# EAGLE schematic SmartSwitchBoard-2x2LK (EAGLE 6.2)
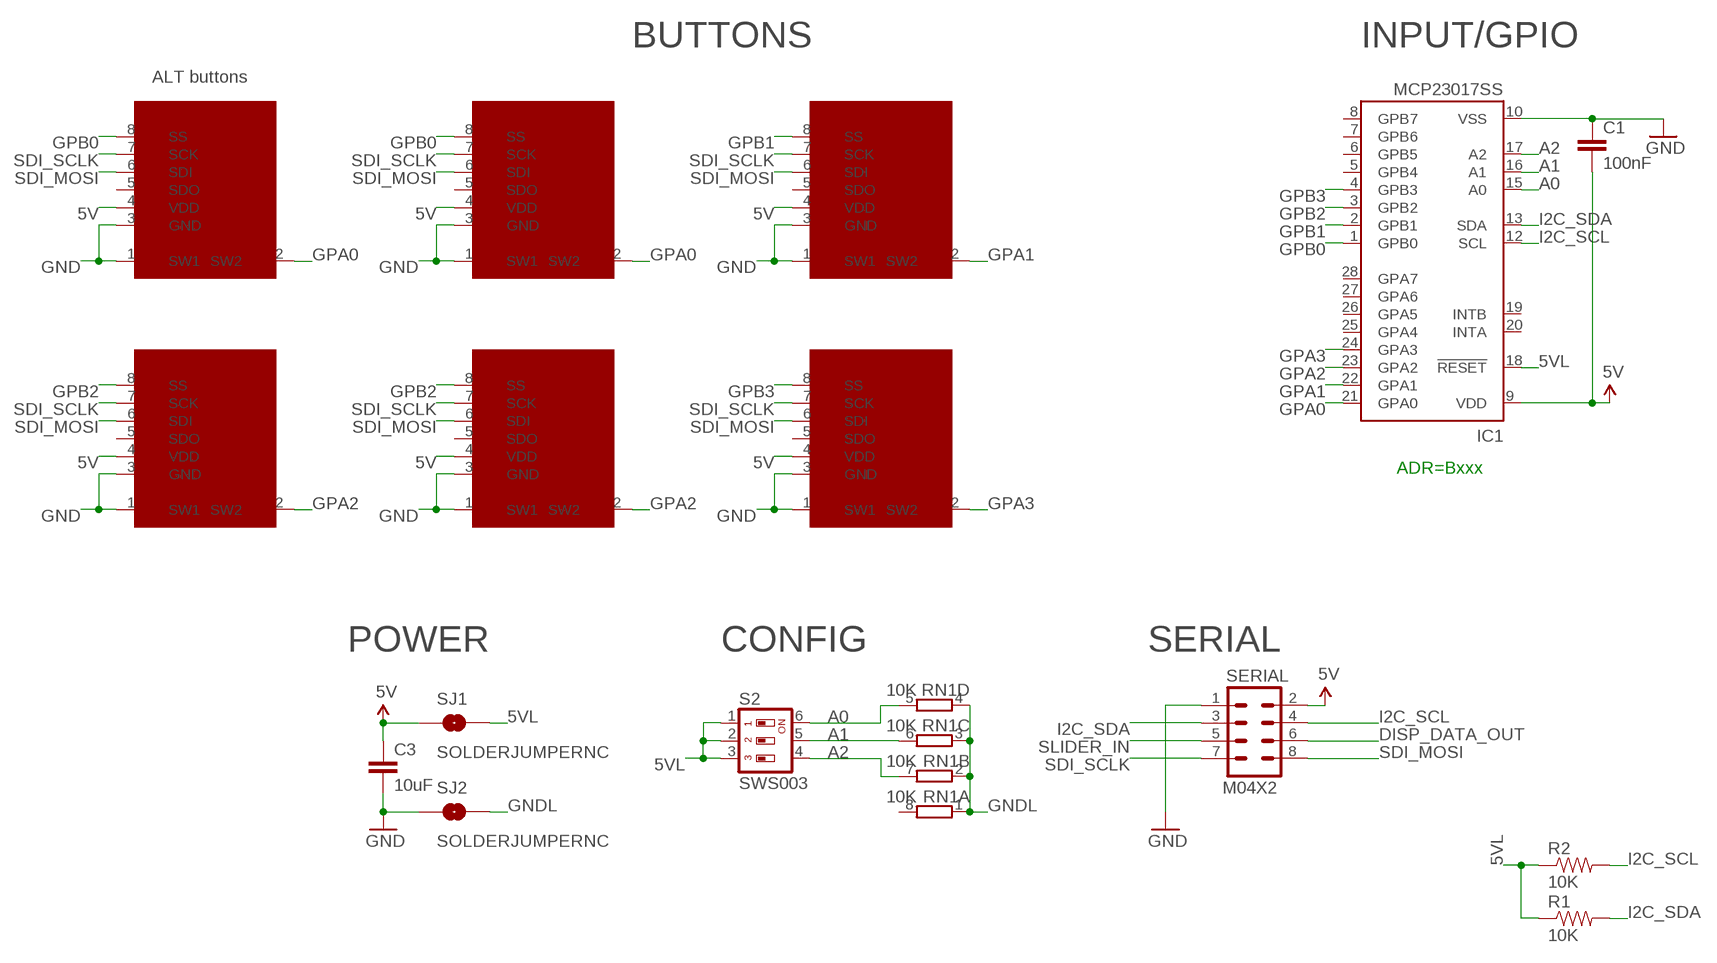
[diagram p0: schematic, sheet 1]

## Parts
C1  100nF  CAP0603-CAP  [0603-CAP]
C3  10uF  CAP0805  [0805]
IC1  MCP23017SS  [SSOP28]
R1  10K  RESISTOR0603-RES  [0603-RES]
R2  10K  RESISTOR0603-RES  [0603-RES]
RN1  10K  4R-NCAY16  [CAY16_HAND]
S2  SWS003  [SMS-003]
SERIAL  M04X2  [2X4]
SJ1  SOLDERJUMPERNC  [SJ_2S]
SJ2  SOLDERJUMPERNC  [SJ_2S]
U$2  SMART_SWITCHSMART_SWITCH_8PIN  [SMART_SWITCH]
U$3  SMART_SWITCHSMART_SWITCH_8PIN  [SMART_SWITCH]
U$4  SMART_SWITCHSMART_SWITCH_8PIN  [SMART_SWITCH]
U$5  SMART_SWITCHSMART_SWITCH_8PIN  [SMART_SWITCH]
U$6  SMART_SWITCHSMART_SWITCH_8PIN  [SMART_SWITCH]
U$7  SMART_SWITCHSMART_SWITCH_8PIN  [SMART_SWITCH]

## Nets
5V [Power]: C1.2 C3.1 IC1.9(VDD) SERIAL.2 SJ1.1 U$2.4(VDD) U$3.4(VDD) U$4.4(VDD) U$5.4(VDD) U$6.4(VDD) U$7.4(VDD)
5VL: IC1.18(!RESET) R1.1 R2.1 S2.1 S2.2 S2.3 SJ1.2
A0: IC1.15(A0) RN1.5 S2.6
A1: IC1.16(A1) RN1.6 S2.5
A2: IC1.17(A2) RN1.7 S2.4
DISP_DATA_OUT: SERIAL.6
GND [Power]: C1.1 C3.2 IC1.10(VSS) SERIAL.1 SJ2.1 U$2.1(SW1) U$2.3(GND) U$3.1(SW1) U$3.3(GND) U$4.1(SW1) U$4.3(GND) U$5.1(SW1) U$5.3(GND) U$6.1(SW1) U$6.3(GND) U$7.1(SW1) U$7.3(GND)
GNDL: RN1.1 RN1.2 RN1.3 RN1.4 SJ2.2
GPA0: IC1.21(GPA0) U$2.2(SW2) U$6.2(SW2)
GPA1: IC1.22(GPA1) U$3.2(SW2)
GPA2: IC1.23(GPA2) U$4.2(SW2) U$7.2(SW2)
GPA3: IC1.24(GPA3) U$5.2(SW2)
GPB0: IC1.1(GPB0) U$2.8(SS) U$6.8(SS)
GPB1: IC1.2(GPB1) U$3.8(SS)
GPB2: IC1.3(GPB2) U$4.8(SS) U$7.8(SS)
GPB3: IC1.4(GPB3) U$5.8(SS)
I2C_SCL: IC1.12(SCL) R2.2 SERIAL.4
I2C_SDA: IC1.13(SDA) R1.2 SERIAL.3
SDI_MOSI: SERIAL.8 U$2.6(SDI) U$3.6(SDI) U$4.6(SDI) U$5.6(SDI) U$6.6(SDI) U$7.6(SDI)
SDI_SCLK: SERIAL.7 U$2.7(SCK) U$3.7(SCK) U$4.7(SCK) U$5.7(SCK) U$6.7(SCK) U$7.7(SCK)
SLIDER_IN: SERIAL.5
Unconnected: IC1.5(GPB4) IC1.6(GPB5) IC1.7(GPB6) IC1.8(GPB7) IC1.19(INTB) IC1.20(INTA) IC1.25(GPA4) IC1.26(GPA5) IC1.27(GPA6) IC1.28(GPA7) RN1.8 U$2.5(SDO) U$3.5(SDO) U$4.5(SDO) U$5.5(SDO) U$6.5(SDO) U$7.5(SDO)

## Notes on the sheet
- BUTTONS | INPUT/GPIO
- ALT buttons
- ADR=Bxxx
- POWER | CONFIG | SERIAL

## Library data of the parts
C1 C3 = SparkFun:CAP: Capacitor Standard 0603 ceramic capacitor, and 0.1" leaded capacitor.
IC1 = microchip:MCP23017: http://ww1.microchip.com/downloads/en/DeviceDoc/21952a.pdf Source: http://ww1.microchip.com/downloads/en/DeviceDoc/21952a.pdf; MF: MICROCHIP; MPN: MCP23017-E/SS; OC_FARNELL: 1467674; OC_NEWARK: 31K2960
R1 R2 = SparkFun:RESISTOR: Resistor Basic schematic elements and footprints for 0603, 1206, and PTH resistors.
RN1 = SKAARHOJ:4R-N: Array Chip Resistor Source: RS Component / Phycomp; OC_FARNELL: unknown; OC_NEWARK: unknown
S2 = smd-special:SWS003: SMD Dip Switch 3 pol.
SERIAL = SparkFun:M04X2
SJ1 SJ2 = SparkFun:SOLDERJUMPER: Solder Jumper Standard SMD solder jumper. Used to automate production. Two varients : Normally Open and Normally Closed are the same, but have different paste layers. NC will have a large amount of paste and should jumper during reflow.
U$2-U$7 = SKAARHOJ:SMART_SWITCH: SMARTSWITCH IS15DSBFP4RGB www.nkksmartswitch.com

## Net classes
0 default: width 0.203 mm, drill 0.406 mm, clearance 0.203 mm
1 Power: width 0.406 mm, drill 0.61 mm, clearance 0.203 mm